# Altium schematic sheet SCH-3-ESC1.SchDoc
size Letter; SheetNumber: 2
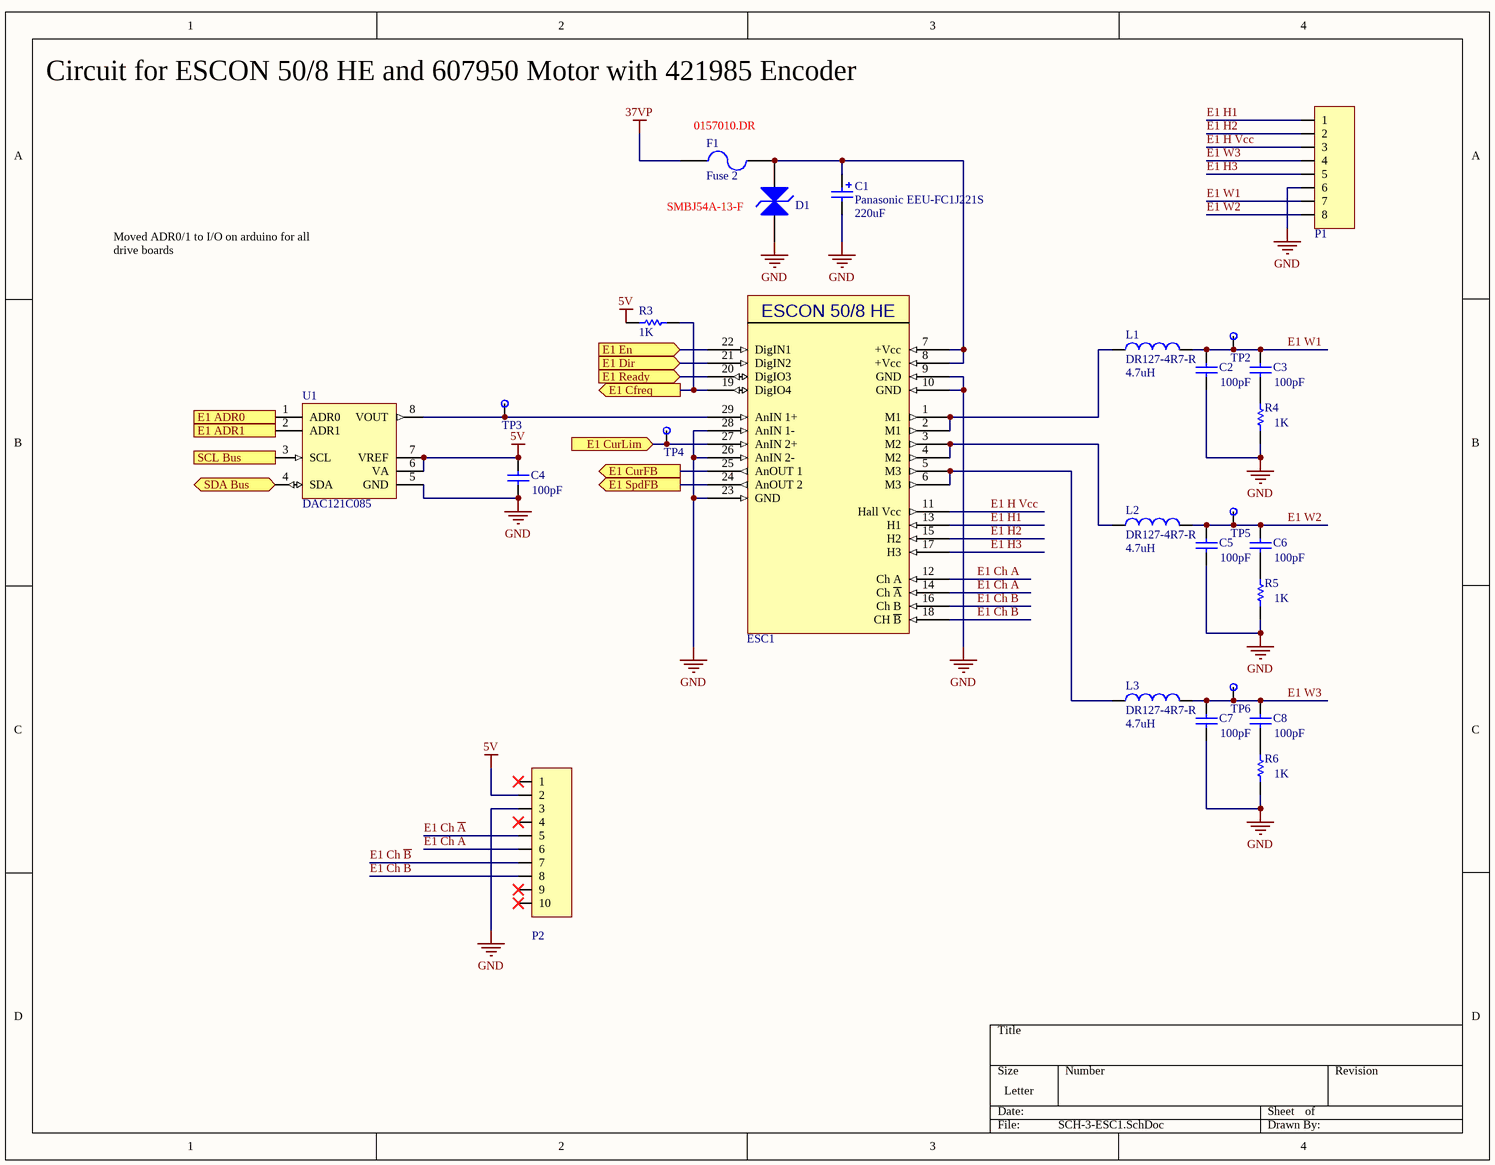
[diagram p0: SCH-3-ESC1.SchDoc]

## Parts
C1  Panasonic EEU-FC1J221S  value 220uF  [Panasonic EEU-FC1J221S]
C2  value 100pF  [C1206]  (hidden comment: Cap Semi)
C3  value 100pF  [C1206]  (hidden comment: Cap Semi)
C4  value 100pF  [C1206]  (hidden comment: Cap Semi)
C5  value 100pF  [C1206]  (hidden comment: Cap Semi)
C6  value 100pF  [C1206]  (hidden comment: Cap Semi)
C7  value 100pF  [C1206]  (hidden comment: Cap Semi)
C8  value 100pF  [C1206]  (hidden comment: Cap Semi)
D1  TVS_DIODE  [SMBJ54A-13-F]  (value not drawn)
ESC1  ESCON 50/8 HE  [ESCON 50/8 HE]  (value not drawn)
F1  Fuse 2  [0157010.DR]
L1  DR127-4R7-R  value 4.7uH  [DR127-4R7-R]
L2  DR127-4R7-R  value 4.7uH  [DR127-4R7-R]
L3  DR127-4R7-R  value 4.7uH  [DR127-4R7-R]
P1  0039281083  [Molex Mini-Fit Jr 0039281083]  (value not drawn)
P2  Header_10_Pos_Ribbon Male  [3M_2510-6002UB]  (value not drawn)
R3  value 1K  [RESC1608X06N_0603]  (hidden comment: Res1)
R4  value 1K  [RESC1608X06N_0603]  (hidden comment: Res1)
R5  value 1K  [RESC1608X06N_0603]  (hidden comment: Res1)
R6  value 1K  [RESC1608X06N_0603]  (hidden comment: Res1)
TP2  TestPt  [50_MIL_PAD]  (value not drawn)
TP3  TestPt  [50_MIL_PAD]  (value not drawn)
TP4  TestPt  [50_MIL_PAD]  (value not drawn)
TP5  TestPt  [50_MIL_PAD]  (value not drawn)
TP6  TestPt  [50_MIL_PAD]  (value not drawn)
U1  DAC121C085  [MUA08A_L]

## Ports
E1 ADR0 (in), E1 ADR1 (in), E1 Cfreq (out), E1 CurFB (out), E1 CurLim (in), E1 Dir (in), E1 En (in), E1 Ready (in), E1 SpdFB (out), SCL Bus (in), SDA Bus (bidir)

## Nets
5V: C4.2 P2.2 R3.2 U1.6(VA) U1.7(VREF)
37VP: F1.1
GND: C1.2 C2.1 C4.1 C5.1 C7.1 D1.1(A) ESC1.9(GND) ESC1.10(GND) ESC1.23(GND) ESC1.26(AnIN_2-) ESC1.28(AnIN_1-) P1.6 P2.3 R4.1 R5.1 R6.1 U1.5(GND)
E1 ADR0: U1.1(ADR0) ; port E1 ADR0
E1 ADR1: U1.2(ADR1) ; port E1 ADR1
E1 Cfreq: ESC1.19(DigIO4) R3.1 ; port E1 Cfreq
E1 Ch A: ESC1.12(Ch_A) P2.6
E1 Ch ~{A}: ESC1.14(Ch_~{A}) P2.5
E1 Ch B: ESC1.16(Ch_B) P2.8
E1 Ch ~{B}: ESC1.18(CH_~{B}) P2.7
E1 CurFB: ESC1.25(AnOUT_1) ; port E1 CurFB
E1 CurLim: ESC1.27(AnIN_2+) TP4.1 ; port E1 CurLim
E1 Dir: ESC1.21(DigIN2) ; port E1 Dir
E1 En: ESC1.22(DigIN1) ; port E1 En
E1 H1: ESC1.13(H1) P1.1
E1 H2: ESC1.15(H2) P1.2
E1 H3: ESC1.17(H3) P1.5
E1 H Vcc: ESC1.11(Hall_Vcc) P1.3
E1 Ready: ESC1.20(DigIO3) ; port E1 Ready
E1 SpdFB: ESC1.24(AnOUT_2) ; port E1 SpdFB
E1 W1: C2.2 C3.2 L1.2 P1.7 TP2.1
E1 W2: C5.2 C6.2 L2.2 P1.8 TP5.1
E1 W3: C7.2 C8.2 L3.2 P1.4 TP6.1
SCL Bus: U1.3(SCL) ; port SCL Bus
SDA Bus: U1.4(SDA) ; port SDA Bus
NetC1_1: C1.1 D1.2(K) ESC1.7(+Vcc) ESC1.8(+Vcc) F1.2
NetC3_1: C3.1 R4.2
NetC6_1: C6.1 R5.2
NetC8_1: C8.1 R6.2
NetESC1_1: ESC1.1(M1) ESC1.2(M1) L1.1
NetESC1_3: ESC1.3(M2) ESC1.4(M2) L2.1
NetESC1_5: ESC1.5(M3) ESC1.6(M3) L3.1
NetESC1_29: ESC1.29(AnIN_1+) TP3.1 U1.8(VOUT)

Not connected (* = marked no-connect by the designer): P2 1* 4* 9* 10*

## Notes on the sheet
- Circuit for ESCON 50/8 HE and 607950 Motor with 421985 Encoder
- (near F1) 0157010.DR
- SMBJ54A-13-F
- Moved ADR0/1 to I/O on arduino for all drive boards

## Library data of the parts
C1 = Panasonic EEU-FC1J221S: Polarized Capacitor (Radial)
C2-C8 = Cap Semi: Capacitor (Semiconductor SIM Model); Published: 8-Jun-2000; LatestRevisionDate: 29-May-2009; LatestRevisionNote: IPC-7351 Footprint Added.; PackageReference: C1206; Publisher: Altium Limited; PackageDescription: Chip Capacitor
D1 = TVS_DIODE: TVS Diode; Published: 8-Jun-2000; LatestRevisionDate: 17-Jul-2002; LatestRevisionNote: Re-released for DXP Platform.; PackageVersion: Sep-1996; PackageReference: SMC; Publisher: Altium Limited; PackageDescription: DO-214-AB/SMC; 2 C-Bend Leads; Body 7.9 x 5.9 mm, inc. leads (LxW); Code_JEDEC: DO-214-AB
ESC1 = ESCON 50/8 HE: ESCON Module 50/8 HE Servocontroller
F1 = Fuse 2: Fuse; Published: 8-Jun-2000; LatestRevisionDate: 17-Jul-2002; LatestRevisionNote: Re-released for DXP Platform.; PackageReference: PIN-W2/E2.8; Publisher: Altium Limited; PackageDescription: Thru-Hole; 2 Leads
L1-L3 = DR127-4R7-R: 4.7µH Shielded Wirewound Inductor 8.25A 9.17mOhm Nonstandard; Code_IEC: 1005; Published: 8-Jun-2000; LatestRevisionDate: 29-May-2009; LatestRevisionNote: IPC-7351 Footprint Added.; PackageReference: 0402-A; Publisher: Altium Limited; PackageDescription: Chip Inductor; Code_JEITA: 0402
P1 = Molex Mini-Fit Jr 8pos Vert: Mini-Fit Jr, 8 pos 2 row
P2 = Header_10_Pos_Ribbon Male: IDC, 10 pos, Male
R3-R6 = Res1: Resistor; Published: 8-Jun-2000; LatestRevisionDate: 17-Jul-2002; LatestRevisionNote: Re-released for DXP Platform.; PackageReference: AXIAL-0.3; Publisher: Altium Limited; PackageDescription: Axial Device, Thru-Hole; 2 Leads; 0.3 in Pin Spacing
U1 = DAC121C085: 12-Bit Micro Power Digital-to-Analog Converter with an I2C-Compatible Interface and External Reference, 8-pin Mini SOIC, Pb-Free; Manufacturer: National Semiconductor; PackageTopMarking: XTT*X90C; PowerWise: Y; CompType: D/A Converter; ComponentLink3URL: http://www.national.com/packaging/folders/mua08a.html; ComponentLink2URL: http://www.national.com/pf/DA/DAC121C085.html; Code_JEDEC: MO-187-AA; ComponentLink1URL: http://www.national.com/ds/DA/DAC121C085.pdf; RoHS: Y; PackageVersion: revF, Apr-2008; PackageDescription: MINI SOIC, .118 x .118 x .034in, 8 Lead, .0256in Pitch; PackageReference: MUA08A; PinCount: 8; DatasheetVersion: Mar-2008; ComponentLink1Description: DAC121C085 Datasheet; ComponentLink2Description: DAC121C085 Web Page; ComponentLink3Description: MUA08A Package Page; RevisionNote: Component URLs added